# Altium schematic sheet sch.SchDoc
size A4; Projectnumber: OWN-000; Size: A4
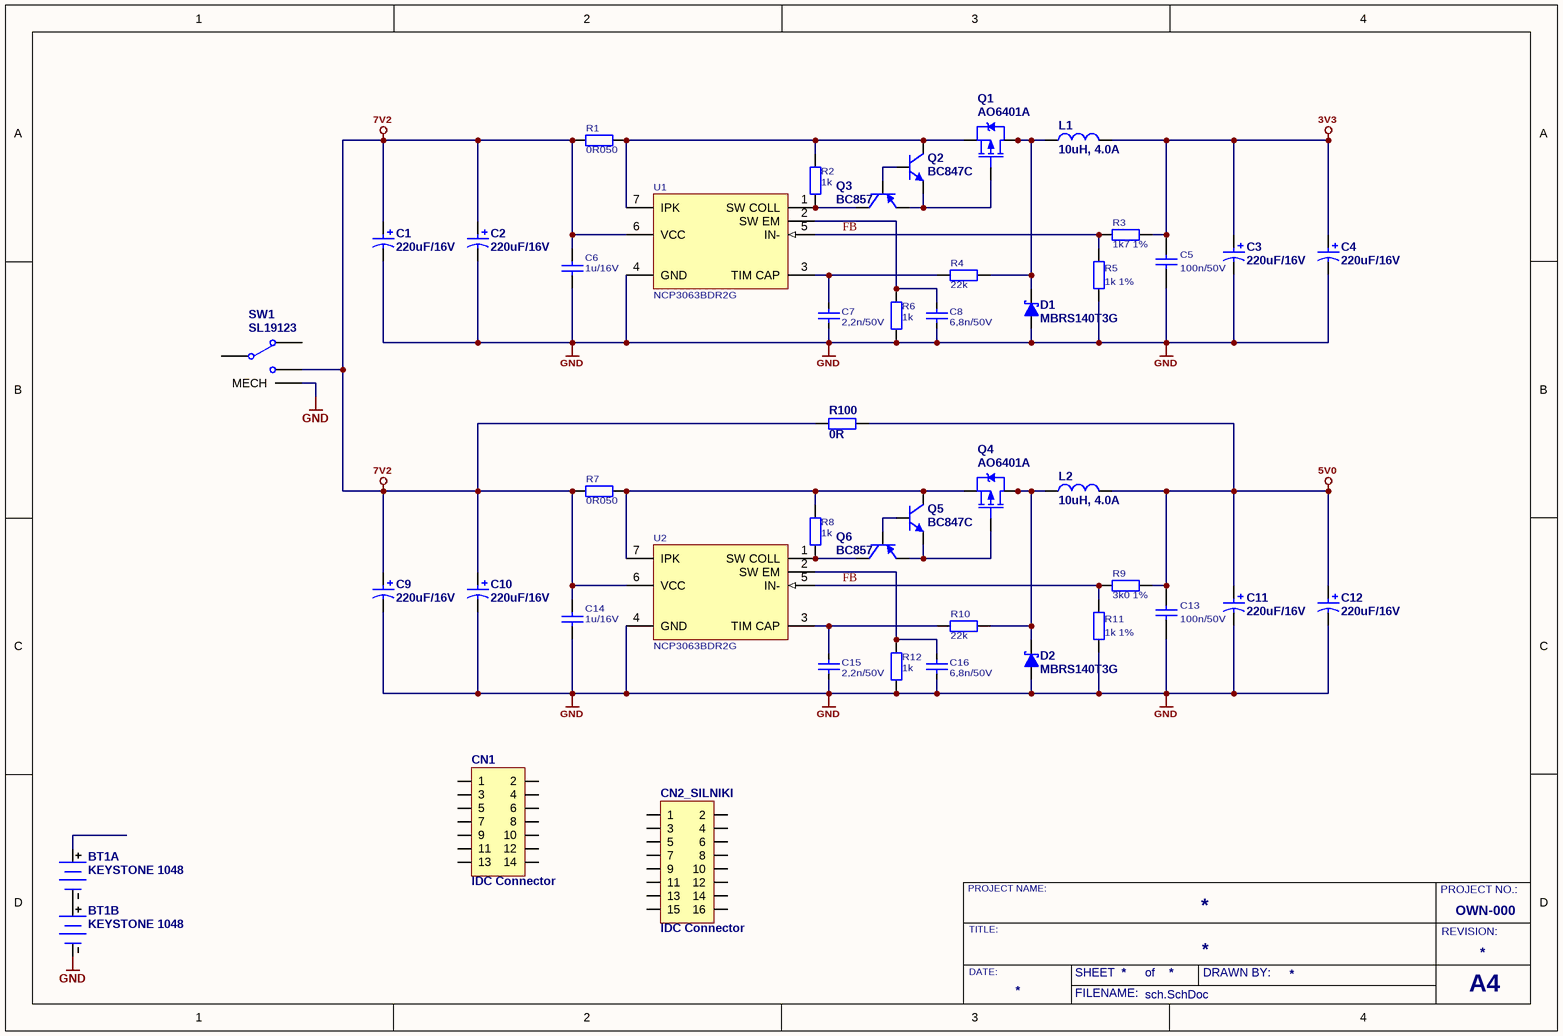
[diagram p0: sch.SchDoc]

## Parts
BT1  KEYSTONE 1048  [KEYSTONE_1048]  (parts A,B of 2)  (no BOM)
C1  220uF/16V  [CES_E_8.3x8.3_6.2]
C2  220uF/16V  [CES_E_8.3x8.3_6.2]
C3  220uF/16V  [CES_E_8.3x8.3_6.2]
C4  220uF/16V  [CES_E_8.3x8.3_6.2]
C5  100n/50V  [C0805]
C6  1u/16V  [C0805]
C7  2,2n/50V  [C0805]
C8  6,8n/50V  [C0805]
C9  220uF/16V  [CES_E_8.3x8.3_6.2]
C10  220uF/16V  [CES_E_8.3x8.3_6.2]
C11  220uF/16V  [CES_E_8.3x8.3_6.2]
C12  220uF/16V  [CES_E_8.3x8.3_6.2]
C13  100n/50V  [C0805]
C14  1u/16V  [C0805]
C15  2,2n/50V  [C0805]
C16  6,8n/50V  [C0805]
CN1  IDC Connector  [IDC14_RA]
CN2_SILNIKI  IDC Connector  [IDC16_RA]
D1  MBRS140T3G  [SMB]
D2  MBRS140T3G  [SMB]
L1  10uH, 4.0A  [DE1205]
L2  10uH, 4.0A  [DE1205]
Q1  AO6401A  [SOT-23-6]
Q2  BC847C  [SOT-23]
Q3  BC857  [SOT-23]
Q4  AO6401A  [SOT-23-6]
Q5  BC847C  [SOT-23]
Q6  BC857  [SOT-23]
R1  0R050  [R0805]
R2  1k  [R0805]
R3  1k7 1%  [R0805]
R4  22k  [R0805]
R5  1k 1%  [R0805]
R6  1k  [R0805]
R7  0R050  [R0805]
R8  1k  [R0805]
R9  3k0 1%  [R0805]
R10  22k  [R0805]
R11  1k 1%  [R0805]
R12  1k  [R0805]
R100  0R  [R1206]
SW1  SL19123  [500SSPxS1M6xEA]
U1  NCP3063BDR2G  [SO8]
U2  NCP3063BDR2G  [SO8]

## Nets
3V3: C3.1 C4.1 C5.2 L1.2 R3.2
5V0: C11.1 C12.1 C13.2 L2.2 R9.2 R100.2
7V2: C1.1 C2.1 C6.2 C9.1 C10.1 C14.2 R1.1 R7.1 R100.1 SW1.3 U1.6(VCC) U2.6(VCC)
GND: BT1.3(-) C1.2 C2.2 C3.2 C4.2 C5.1 C6.1 C7.1 C8.1 C9.2 C10.2 C11.2 C12.2 C13.1 C14.1 C15.1 C16.1 D1.1(A) D2.1(A) R5.2 R6.2 R11.2 R12.2 SW1.M(MECH) U1.4(GND) U2.4(GND)
FB: R3.1 R5.1 R9.1 R11.1 U1.5(IN-) U2.5(IN-)
NetBT1_2: BT1.2(-) BT1.4(+)
NetC7_2: C7.2 R4.2 U1.3(TIM_CAP)
NetC8_2: C8.2 R6.1 U1.2(SW_EM)
NetC15_2: C15.2 R10.2 U2.3(TIM_CAP)
NetC16_2: C16.2 R12.1 U2.2(SW_EM)
NetD1_2: D1.2(K) L1.1 Q1.1(D) Q1.2(D) Q1.5(D) Q1.6(D) R4.1
NetD2_2: D2.2(K) L2.1 Q4.1(D) Q4.2(D) Q4.5(D) Q4.6(D) R10.1
NetQ1_3: Q1.3(G) Q2.2(E) Q3.2(E)
NetQ1_4: Q1.4(S) Q2.3(C) R1.2 R2.1 U1.7(IPK)
NetQ2_1: Q2.1(B) Q3.1(B)
NetQ3_3: Q3.3(C) R2.2 U1.1(SW_COLL)
NetQ4_3: Q4.3(G) Q5.2(E) Q6.2(E)
NetQ4_4: Q4.4(S) Q5.3(C) R7.2 R8.1 U2.7(IPK)
NetQ5_1: Q5.1(B) Q6.1(B)
NetQ6_3: Q6.3(C) R8.2 U2.1(SW_COLL)

Not connected (* = marked no-connect by the designer): BT1 1(+); CN1 1 2 3 4 5 6 7 8 9 10 11 12 13 14; CN2_SILNIKI 1 2 3 4 5 6 7 8 9 10 11 12 13 14 15 16; SW1 1 2

## Notes on the sheet
- PROJECT NAME:
- PROJECT NO.:
- DATE:
- TITLE:
- SHEET
- of
- DRAWN BY:
- REVISION:
- FILENAME:
- A4

## Library data of the parts
BT1 = 18650_x2: 2x 18650 LiPo Acu in the KEYSTONE 1048 Holder; Published: 14-Sep-2006
C1-C4 C9-C12 = Cap Pol: Polarized Capacitor; ComponentLink1Description: datasheet; ComponentLink2Description: supplier; Value: 220uF/16V
C5-C8 C13-C16 = Cap: Capacitor; ComponentLink1Description: datasheet; ComponentLink2Description: supplier
  C5 C13: Value: 100n/50V
  C6 C14: Value: 1u/16V
  C7 C15: Value: 2,2n/50V
  C8 C16: Value: 6,8n/50V
CN1 = CN_7x2
CN2_SILNIKI = CN_8x2
D1 D2 = MBRS140T3G: Schottky barrier rectifier: 40V, 1A; Published: 22-Nov-2006; PackageReference: SMB; Supplier 1: TME; Supplier 2: Farnell; Supplier Part Number 1: MBRS140T3G; Supplier Part Number 2: 1467526
L1 L2 = DE1205-10: Published: 08-Mar-2006; ComponentLink1Description: datasheet; ComponentLink2Description: supplier; Supplier 1: TME; Supplier Part Number 1: DE1205-10; Value: 10uH, 4.0A
Q1 Q4 = AO6401A: P-Channel MOSFET; -60V, -5A, 1.3W;; Supplier 1: TME; Supplier Part Number 1: AO6401A
Q2 Q5 = BC847C: NPN General Purpose Transistor (VCE=45V, IC=100mA, HFE=420-800); PowerRating: 250mW; VCEO: 45V; IC: 100mA; HFE: 420-800; Supplier 1: Farnell; Supplier 2: Mouser; Supplier 3: Farnell; Supplier 4: Farnell; Supplier 5: Farnell; Supplier 6: Farnell; Supplier 7: Farnell; Supplier 8: Farnell; Supplier 9: Farnell; Supplier 10: TME; Supplier 11: TME; Supplier 12: TME; Supplier Part Number 1: 1081235; Supplier Part Number 2: 512-BC847CMTF; Supplier Part Number 3: 2319372; Supplier Part Number 4: 1081235RL; Supplier Part Number 5: 1574344RL; Supplier Part Number 6: 1574344; Supplier Part Number 7: 2317857; Supplier Part Number 8: 1459038RL; Supplier Part Number 9: 1459038; Supplier Part Number 10: BC847C; Supplier Part Number 11: BC847C-DIO; Supplier Part Number 12: BC847C.215
Q3 Q6 = BC857: PNP General Purpose Transistor (VCE=-45V, IC=-100mA)
R1-R12 R100 = Res: Resistor; Published: 19-Feb-2006; ComponentLink1Description: datasheet; ComponentLink2Description: supplier
  R1 R7: Value: 0R050
  R2 R6 R8 R12: Value: 1k
  R3: Value: 1k7 1%
  R4 R10: Value: 22k
  R5 R11: Value: 1k 1%
  R9: Value: 3k0 1%
  R100: Value: 0R
SW1 = SL19123: Canal Electronic SPDT AC: 3A/250V, DC: 6A/28V; Supplier 1: TME; Supplier Part Number 1: SL19123
U1 U2 = NCP3063BDR2G: DC-DC Converter NCP3063BDR2G (Farnell 1547126); Published: 22-Nov-2006; PackageReference: SO8; Supplier 1: Farnell; Supplier 2: Farnell; Supplier 3: Farnell; Supplier Part Number 1: 1547126; Supplier Part Number 2: 2126136; Supplier Part Number 3: 1547126RL